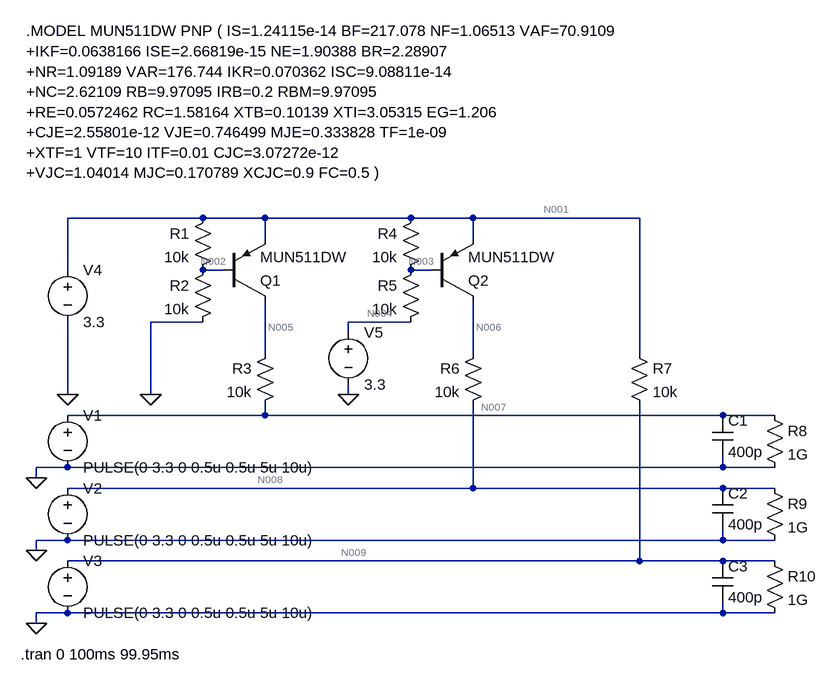
[diagram p0: schematic i2c_enable.asc]
i2c_enable.asc, the LTspice schematic file:
Version 4
SHEET 1 1220 680
WIRE 32 -368 -176 -368
WIRE 128 -368 32 -368
WIRE 352 -368 128 -368
WIRE 448 -368 352 -368
WIRE 704 -368 448 -368
WIRE 128 -336 128 -368
WIRE 448 -336 448 -368
WIRE -176 -288 -176 -368
WIRE 64 -288 32 -288
WIRE 384 -288 352 -288
WIRE 32 -208 -48 -208
WIRE 352 -208 256 -208
WIRE 256 -192 256 -208
WIRE 128 -160 128 -240
WIRE 448 -160 448 -240
WIRE 704 -160 704 -368
WIRE -176 -96 -176 -208
WIRE -48 -96 -48 -208
WIRE 256 -96 256 -112
WIRE 128 -64 128 -80
WIRE 128 -64 -176 -64
WIRE 832 -64 128 -64
WIRE 912 -64 832 -64
WIRE -176 16 -224 16
WIRE 832 16 832 0
WIRE 832 16 -176 16
WIRE 912 16 832 16
WIRE -224 32 -224 16
WIRE 448 48 448 -80
WIRE 448 48 -176 48
WIRE 832 48 448 48
WIRE 912 48 832 48
WIRE -176 128 -224 128
WIRE 832 128 832 112
WIRE 832 128 -176 128
WIRE 912 128 832 128
WIRE -224 144 -224 128
WIRE 704 160 704 -80
WIRE 704 160 -176 160
WIRE 832 160 704 160
WIRE 912 160 832 160
WIRE -176 240 -224 240
WIRE 832 240 832 224
WIRE 832 240 -176 240
WIRE 912 240 832 240
WIRE -224 256 -224 240
FLAG -224 32 0
FLAG -224 144 0
FLAG -224 256 0
FLAG -48 -96 0
FLAG 256 -96 0
FLAG -176 -96 0
SYMBOL res 48 -384 M0
SYMATTR InstName R1
SYMATTR Value 10k
SYMBOL res 48 -304 M0
SYMATTR InstName R2
SYMATTR Value 10k
SYMBOL res 144 -176 M0
SYMATTR InstName R3
SYMATTR Value 10k
SYMBOL res 368 -384 M0
SYMATTR InstName R4
SYMATTR Value 10k
SYMBOL res 368 -304 M0
SYMATTR InstName R5
SYMATTR Value 10k
SYMBOL res 464 -176 M0
SYMATTR InstName R6
SYMATTR Value 10k
SYMBOL res 688 -176 R0
SYMATTR InstName R7
SYMATTR Value 10k
SYMBOL voltage -176 -80 R0
WINDOW 123 0 0 Left 0
WINDOW 39 0 0 Left 0
SYMATTR InstName V1
SYMATTR Value PULSE(0 3.3 0 0.5u 0.5u 5u 10u)
SYMBOL voltage -176 32 R0
WINDOW 123 0 0 Left 0
WINDOW 39 0 0 Left 0
SYMATTR InstName V2
SYMATTR Value PULSE(0 3.3 0 0.5u 0.5u 5u 10u)
SYMBOL voltage -176 144 R0
WINDOW 123 0 0 Left 0
WINDOW 39 0 0 Left 0
SYMATTR InstName V3
SYMATTR Value PULSE(0 3.3 0 0.5u 0.5u 5u 10u)
SYMBOL cap 816 -64 R0
SYMATTR InstName C1
SYMATTR Value 400p
SYMBOL cap 816 48 R0
SYMATTR InstName C2
SYMATTR Value 400p
SYMBOL cap 816 160 R0
SYMATTR InstName C3
SYMATTR Value 400p
SYMBOL res 896 -80 R0
SYMATTR InstName R8
SYMATTR Value 1G
SYMBOL res 896 32 R0
SYMATTR InstName R9
SYMATTR Value 1G
SYMBOL res 896 144 R0
SYMATTR InstName R10
SYMATTR Value 1G
SYMBOL voltage -176 -304 R0
WINDOW 123 0 0 Left 0
WINDOW 39 0 0 Left 0
SYMATTR InstName V4
SYMATTR Value 3.3
SYMBOL voltage 256 -208 R0
WINDOW 123 0 0 Left 0
WINDOW 39 0 0 Left 0
SYMATTR InstName V5
SYMATTR Value 3.3
SYMBOL pnp 64 -240 M180
SYMATTR InstName Q1
SYMATTR Value MUN511DW
SYMBOL pnp 384 -240 M180
SYMATTR InstName Q2
SYMATTR Value MUN511DW
TEXT -248 304 Left 2 !.tran 0 100ms 99.95ms
TEXT -240 -656 Left 2 !.MODEL MUN511DW PNP ( IS=1.24115e-14 BF=217.078 NF=1.06513 VAF=70.9109\n+IKF=0.0638166 ISE=2.66819e-15 NE=1.90388 BR=2.28907\n+NR=1.09189 VAR=176.744 IKR=0.070362 ISC=9.08811e-14\n+NC=2.62109 RB=9.97095 IRB=0.2 RBM=9.97095\n+RE=0.0572462 RC=1.58164 XTB=0.10139 XTI=3.05315 EG=1.206\n+CJE=2.55801e-12 VJE=0.746499 MJE=0.333828 TF=1e-09\n+XTF=1 VTF=10 ITF=0.01 CJC=3.07272e-12\n+VJC=1.04014 MJC=0.170789 XCJC=0.9 FC=0.5 )

The netlist it stands for:
* i2c_enable.asc
R1 N001 N002 10k
R2 N002 0 10k
R3 N005 N007 10k
R4 N001 N003 10k
R5 N003 N004 10k
R6 N006 N008 10k
R7 N001 N009 10k
V1 N007 0 PULSE(0 3.3 0 0.5u 0.5u 5u 10u)
V2 N008 0 PULSE(0 3.3 0 0.5u 0.5u 5u 10u)
V3 N009 0 PULSE(0 3.3 0 0.5u 0.5u 5u 10u)
C1 N007 0 400p
C2 N008 0 400p
C3 N009 0 400p
R8 N007 0 1G
R9 N008 0 1G
R10 N009 0 1G
V4 N001 0 3.3
V5 N004 0 3.3
Q1 N005 N002 N001 0 MUN511DW
Q2 N006 N003 N001 0 MUN511DW
.model NPN NPN
.model PNP PNP
.lib standard.bjt
.tran 0 100ms 99.95ms
.MODEL MUN511DW PNP ( IS=1.24115e-14 BF=217.078 NF=1.06513 VAF=70.9109
+IKF=0.0638166 ISE=2.66819e-15 NE=1.90388 BR=2.28907
+NR=1.09189 VAR=176.744 IKR=0.070362 ISC=9.08811e-14
+NC=2.62109 RB=9.97095 IRB=0.2 RBM=9.97095
+RE=0.0572462 RC=1.58164 XTB=0.10139 XTI=3.05315 EG=1.206
+CJE=2.55801e-12 VJE=0.746499 MJE=0.333828 TF=1e-09
+XTF=1 VTF=10 ITF=0.01 CJC=3.07272e-12
+VJC=1.04014 MJC=0.170789 XCJC=0.9 FC=0.5 )
.backanno
.end

* Results of the author's LTspice run, read from the files saved beside the schematic
* Operating Point, zero values left out:
*   V(n001) = 3.3 V
*   V(n002) = 2.607 V
*   V(n005) = 3.294 V
*   V(n003) = 3.3 V
*   V(n004) = 3.3 V
*   V(n006) = 34.09 nV
*   Ic(Q2) = -3.409 pA
*   Ib(Q2) = 3.396 pA
*   Ic(Q1) = -329.4 µA
*   Ib(Q1) = -191.5 µA
*   Ie(Q1) = 520.8 µA
*   I(R7) = 330 µA
*   I(R6) = 3.409 pA
*   I(R5) = -1.698 pA
*   I(R4) = 1.698 pA
*   I(R3) = 329.4 µA
*   I(R2) = 260.7 µA
*   I(R1) = 69.27 µA
*   I(V5) = -1.698 pA
*   I(V4) = -920.1 µA
*   I(V3) = 330 µA
*   I(V2) = 3.409 pA
*   I(V1) = 329.4 µA
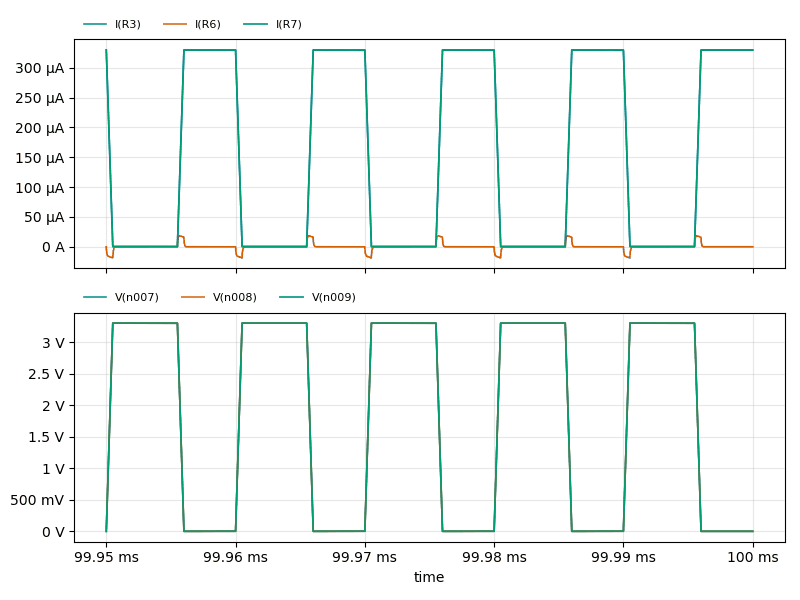
[diagram p1: Transient Analysis of i2c_enable.asc, plotted from the saved traces]
* Transient Analysis, 1 run:
*   I(R3): min 653.2 nA, max 329.4 µA, average 148.6 µA, rms 216.9 µA, last 329.4 µA
*   I(R6): min -18.87 µA, max 18.24 µA, average 358 pA, rms 5.277 µA, last 3.409 pA
*   I(R7): min 0 A, max 330 µA, average 148.5 µA, rms 217.3 µA, last 330 µA
*   V(n007): min 0 V, max 3.3 V, average 1.815 V, rms 2.411 V, last 0 V
*   V(n008): min 0 V, max 3.3 V, average 1.815 V, rms 2.411 V, last 0 V
*   V(n009): min 0 V, max 3.3 V, average 1.815 V, rms 2.411 V, last 0 V